# EAGLE design DatacakeWing (EAGLE 9.1.3)
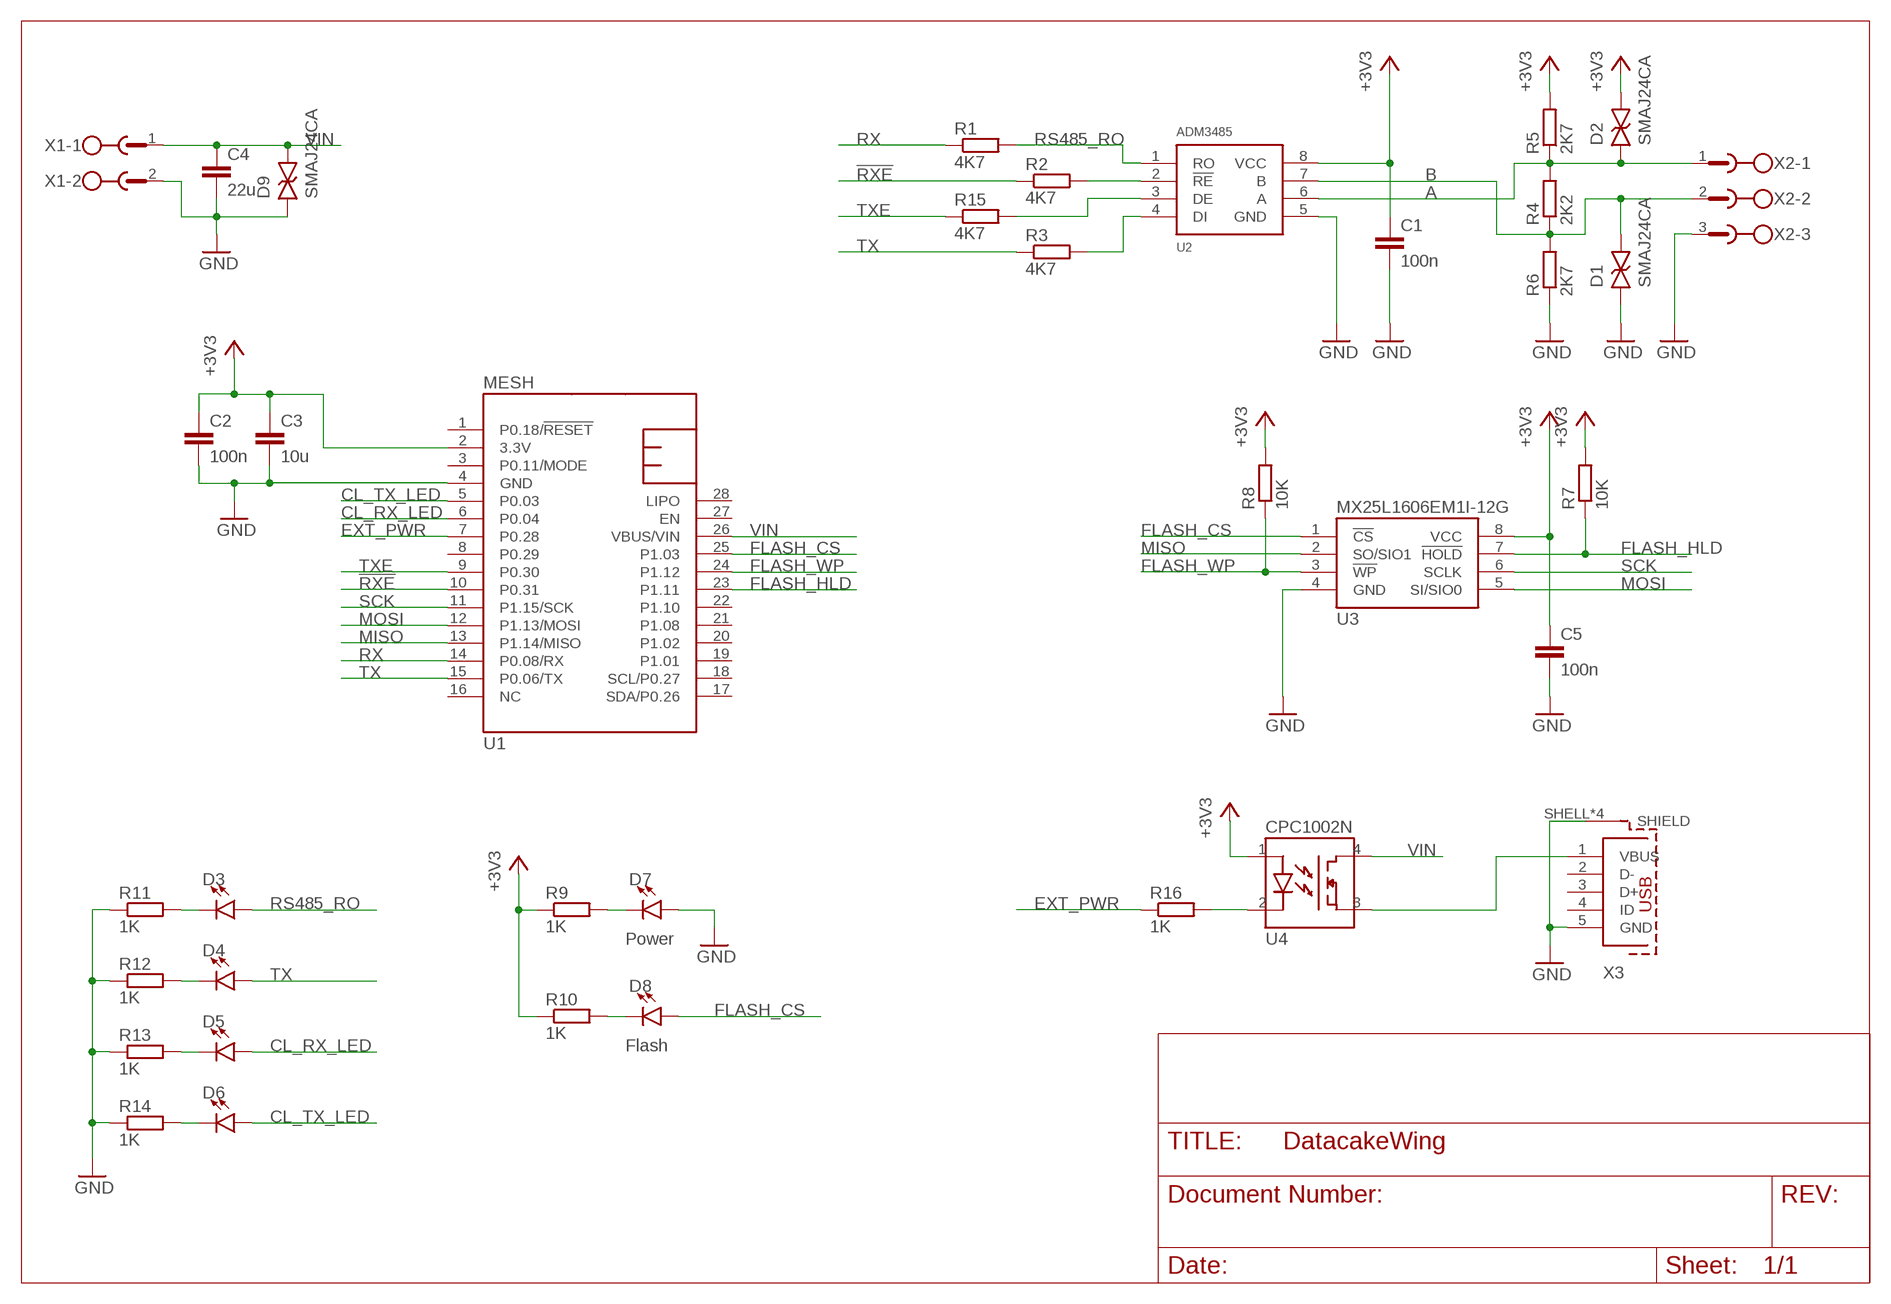
[diagram p0: schematic, sheet 1]

## Parts
C1  100n  C-EUC0603  [C0603]
C2  100n  C-EUC0603  [C0603]
C3  10u  C-EUC0603  [C0603]
C4  22u  C-EUC1210  [C1210]
C5  100n  C-EUC0603  [C0603]
D1  SMAJ24CA  [DO-214AC]
D2  SMAJ24CA  [DO-214AC]
D3  LED0603  [LED-0603]
D4  LED0603  [LED-0603]
D5  LED0603  [LED-0603]
D6  LED0603  [LED-0603]
D7  LED0603  [LED-0603]
D8  LED0603  [LED-0603]
D9  SMAJ24CA  [DO-214AC]
R1  4K7  R-EU_R0402  [R0402]
R2  4K7  R-EU_R0402  [R0402]
R3  4K7  R-EU_R0402  [R0402]
R4  2K2  R-EU_R0402  [R0402]
R5  2K7  R-EU_R0402  [R0402]
R6  2K7  R-EU_R0402  [R0402]
R7  10K  R-EU_R0402  [R0402]
R8  10K  R-EU_R0402  [R0402]
R9  1K  R-EU_R0402  [R0402]
R10  1K  R-EU_R0402  [R0402]
R11  1K  R-EU_R0402  [R0402]
R12  1K  R-EU_R0402  [R0402]
R13  1K  R-EU_R0402  [R0402]
R14  1K  R-EU_R0402  [R0402]
R15  4K7  R-EU_R0402  [R0402]
R16  1K  R-EU_R0402  [R0402]
U1  MESH  [FEATHERWING]
U2  ADM3485  [SO08-0.15]
U3  MX25L1606EM1I-12G  [SO08-0.15]
U4  CPC1002N  [CPC1002N]
X1  MC1,5/2-G-3,5  [MC-2]
X2  MC1,5/3-G-3,5  [MC-3]
X3  629105136821  [629105136821]

## Nets
!RXE: R2.1 U1.10(P0.31)
+3V3: C1.1 C2.1 C3.1 C5.1 D2.2 R5.2 R7.2 R8.2 R9.1 R10.1 U1.2(3.3V) U2.8(VCC) U3.8(VCC) U4.1
A: D2.1 R4.2 R5.1 U2.6(A) X2.1
B: D1.2 R4.1 R6.2 U2.7(B) X2.2
CL_RX_LED: D5.A U1.6(P0.04)
CL_TX_LED: D6.A U1.5(P0.03)
EXT_PWR: R16.1 U1.7(P0.28)
FLASH_CS: D8.A U1.25(P1.03) U3.1(!CS)
FLASH_HLD: R7.1 U1.23(P1.11) U3.7(!HOLD)
FLASH_WP: R8.1 U1.24(P1.12) U3.3(!WP)
GND: C1.2 C2.2 C3.2 C4.2 C5.2 D1.1 D7.A D9.1 R6.1 R11.1 R12.1 R13.1 R14.1 U1.4(GND) U2.5(GND) U3.4(GND) X1.2 X2.3 X3.5(GND) X3.SHELL1(SHIELD) X3.SHELL2(SHIELD) X3.SHELL3(SHIELD) X3.SHELL(SHIELD)
MISO: U1.13(P1.14/MISO) U3.2(SO/SIO1)
MOSI: U1.12(P1.13/MOSI) U3.5(SI/SIO0)
N$1: R2.2 U2.2(!RE)
N$2: D3.C R11.2
N$3: R3.2 U2.4(DI)
N$4: D4.C R12.2
N$5: D5.C R13.2
N$6: D6.C R14.2
N$7: D7.C R9.2
N$8: R15.2 U2.3(DE)
N$9: D8.C R10.2
N$10: U4.3 X3.1(VBUS)
N$12: R16.2 U4.2
RS485_RO: D3.A R1.2 U2.1(RO)
RX: R1.1 U1.14(P0.08/RX)
SCK: U1.11(P1.15/SCK) U3.6(SCLK)
TX: D4.A R3.1 U1.15(P0.06/TX)
TXE: R15.1 U1.9(P0.30)
VIN: C4.1 D9.2 U1.26(VBUS/VIN) U4.4 X1.1
Unconnected: U1.1(P0.18/!RESET) U1.3(P0.11/MODE) U1.8(P0.29) U1.16(NC) U1.17(SDA/P0.26) U1.18(SCL/P0.27) U1.19(P1.01) U1.20(P1.02) U1.21(P1.08) U1.22(P1.10) U1.27(EN) U1.28(LIPO) X3.2(D-) X3.3(D+) X3.4(ID)

## Notes on the sheet
- Power
- Flash

## Library data of the parts
C1-C5 = rcl:C-EU: CAPACITOR, European symbol; SPICEPREFIX: C
D1 D2 D9 = dev:SMAJ24CA: Littlefuse SMAJ24CA The SMAJ series is designed specifically to protect sensitive electronic equipment from voltage transients induced by lightning and other transient voltage events. Datasheet <https://www.littelfuse.com/~/media/electronics/datasheets/tvs_diodes/littelfuse_tvs_diode_smaj_datasheet.pdf.pdf>
D3-D8 = SparkFun-LED:LED: LED (Generic) Standard schematic elements and footprints for 5mm, 3mm, 1206, and 0603 sized LEDs. Generic LEDs with no color specified.
R1-R16 = rcl:R-EU_: RESISTOR, European symbol; SPICEPREFIX: R
U1 = Particle-Devices:MESH
U2 = dev:ADM3485
U3 = dev:MX25L1606E: Macronix Flash MX25L1606E 3V, 10Mbit CMOS Serial Flash Memory
U4 = dev:CPC1002N: IXYS CPC1002N 60V Normally-Open Single-Pole 4-Pin SOP OptoMOS® Relay
X1 = dev:MC1,5/2-G-3,5: Phoenix Contact MC 1,5/ 2-G-3,5 (1844210)
X2 = dev:MC1,5/3-G-3,5: Phoenix Contact MC 1,5/ 3-G-3,5 (1844223)
X3 = Wurth_Elektronik_Electromechanic_Input-Output_Connectors_rev18b:629105136821: WR-COM SMT Horizontal 5 Contacts Micro USB Type B,5 pins=>Code : Con_I-O_COM_MicroUSB_629105136821 <http://katalog.we-online.de/media/images/eican/Con_I-O_COM_MicroUSB_629105136821_pf2.jpg> Details see: http://katalog.we-online.de/en/em/COM_MICRO_SMT_TYPE_B_HORIZONTAL/629105136821?m Created 2014-07-09, Karrer Zheng 2014 (C) Würth Elektronik

## Board
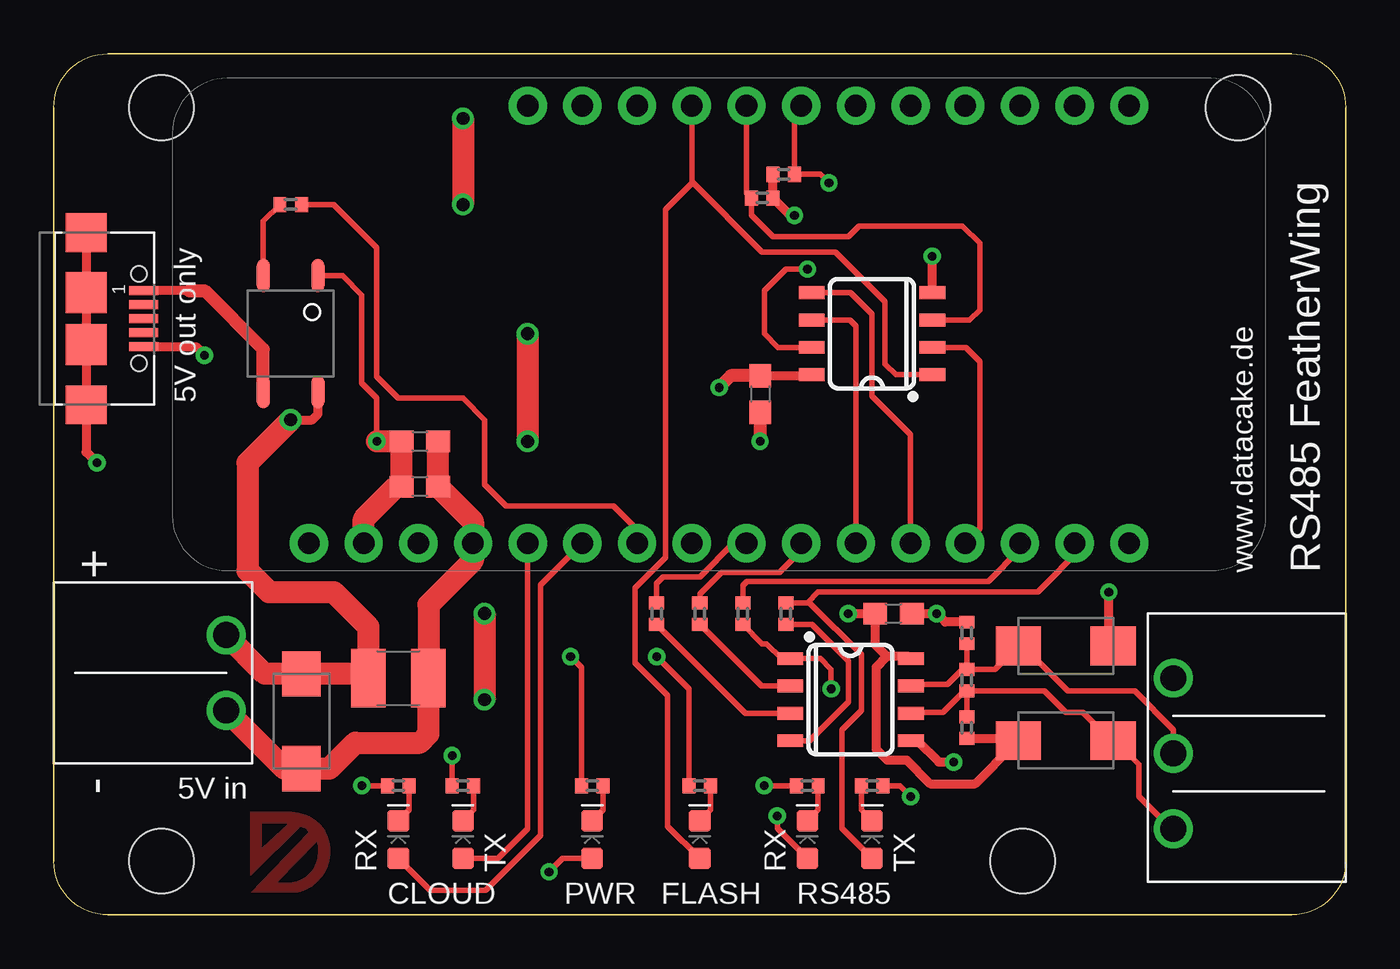
[diagram p1: board, top side]
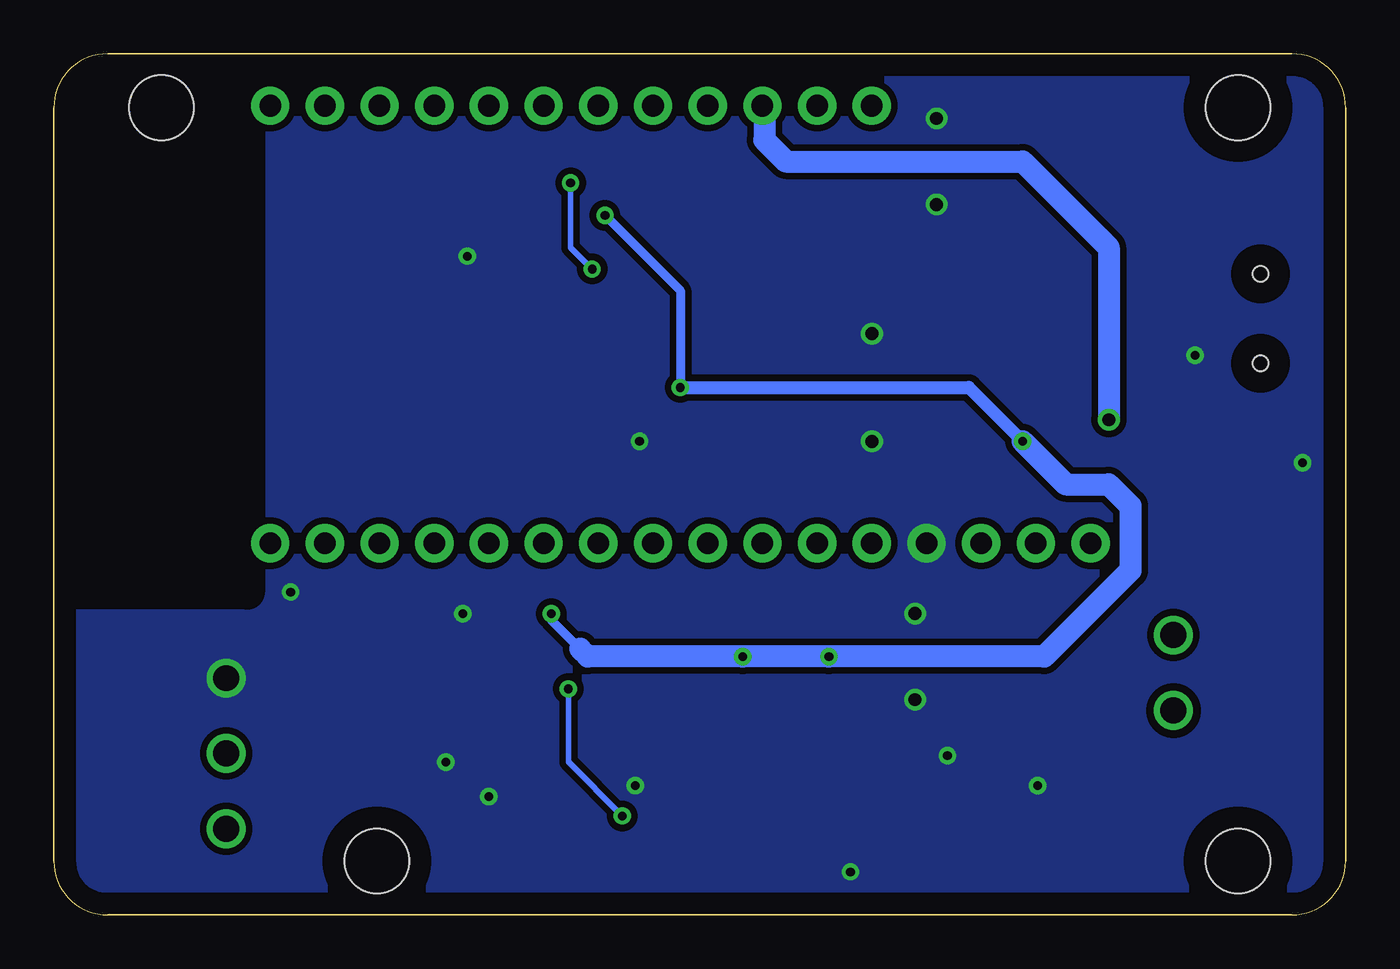
[diagram p2: board, bottom side, seen from below]

Size 60 x 40 mm. Coordinates in mm from the lower left corner, seen from the top.
Outline: 2.5,0 57.5,0
Outline: 60,2.5 60,37.5
Outline: 57.5,40 2.5,40
Outline: 0,37.5 0,2.5
Outline: 2.5,0 arc-90 0,2.5
Outline: 0,37.5 arc-90 2.5,40
Outline: 57.5,40 arc-90 60,37.5
Outline: 60,2.5 arc-90 57.5,0
Outline: 0,2.5 0,37.5
Outline: 2.5,40 57.5,40
Outline: 60,37.5 60,2.5
Outline: 57.5,0 2.5,0
Copper layers (1*16): Top 0.035mm / dielectric 1.6mm / Bottom 0.035mm
Design rules "allpcb_6 *": minimum track width 6mil, minimum drill 0.4mm, track to track 6mil, track to pad 6mil, pad to pad 6mil, via to via 6mil, smd to smd 6mil, copper to edge 40mil, drill to drill 6mil, minimum pad ring 10mil, minimum via ring 8mil, stop-mask expansion 6mil, vias tented up to drill 40mil, thermal gap 10mil
Holes 3 mm at 5,2.5 5,37.5 55,37.5 45,2.5
bRestrict: area 51,15 to 60,40; area 7.1,8.6 to 8.9,10.4

### Footprints (pad centres in the part's own frame; a part is rotated, then mirrored left to right if it is on the bottom)
C0603 = smd 1.1 x 1: 1 -0.85,0; 2 0.85,0
C1210 = smd 1.6 x 2.7: 1 -1.4,0; 2 1.4,0
DO-214AC = smd 2.1 x 1.8: 1 -2.2,0; 2 2.2,0
LED-0603 = smd 1 x 1: A -0.877,0; C 0.877,0
R0402 = smd 0.6 x 0.7: 1 -0.5,0; 2 0.5,0
FEATHERWING = drill 1 pad 1.778: 1 6.35,1.27; 2 8.89,1.27; 3 11.43,1.27; 4 13.97,1.27; 5 16.51,1.27; 6 19.05,1.27; 7 21.59,1.27; 8 24.13,1.27; 9 26.67,1.27; 10 29.21,1.27; 11 31.75,1.27; 12 34.29,1.27; 13 36.83,1.27; 14 39.37,1.27; 15 41.91,1.27; 16 44.45,1.27; 17 44.45,21.59; 18 41.91,21.59; 19 39.37,21.59; 20 36.83,21.59; 21 34.29,21.59; 22 31.75,21.59; 23 29.21,21.59; 24 26.67,21.59; 25 24.13,21.59; 26 21.59,21.59; 27 19.05,21.59; 28 16.51,21.59
SO08-0.15 = smd 0.6 x 1.2: 1 -1.905,-2.8; 2 -0.635,-2.8; 3 0.635,-2.8; 4 1.905,-2.8; 5 1.905,2.8; 6 0.635,2.8; 7 -0.635,2.8; 8 -1.905,2.8
CPC1002N = smd 0.6 x 1.54: 1 -1.27,-2.695; 2 1.27,-2.695; 3 1.27,2.695; 4 -1.27,2.695
MC-2 = drill 1.2: 1 0,0; 2 0,3.5
MC-3 = drill 1.2: 1 0,0; 2 0,3.5; 3 0,7
629105136821 = smd 0.4 x 1.35: 1 -1.3,2.675; 2 -0.65,2.675; 3 0,2.675; 4 0.65,2.675; 5 1.3,2.675 | smd 1.8 x 1.9: SHELL -4,0; SHELL3 4,0 | smd 1.9 x 1.9: SHELL1 -1.2,0; SHELL2 1.2,0 | hole 0.7: -2.075,2.45; 2.075,2.45

### Placement (x,y rotation side)
C1  39,14 0 top
C2  17,19.9 0 top
C3  17,22 0 top
C4  16,11 0 top
C5  32.8,24.2 270 top
D1  47,12.5 180 top
D2  47,8.1 180 top
D3  35,3.5 90 top
D4  38,3.5 90 top
D5  16,3.5 90 top
D6  19,3.5 90 top
D7  25,3.5 90 top
D8  30,3.5 90 top
D9  11.5,9 90 top
R1  32,14 270 top
R2  30,14 270 top
R3  34,14 270 top
R4  42.4,10.9 270 top
R5  42.4,8.7 270 top
R6  42.4,13.1 270 top
R7  33.9,34.4 180 top
R8  32.9,33.3 0 top
R9  25,6 0 top
R10  30,6 0 top
R11  35,6 0 top
R12  38,6 180 top
R13  16,6 0 top
R14  19,6 0 top
R15  28,14 270 top
R16  11,33 180 top
U1  5.5,16 0 top
U2  37,10 270 top
U3  38,27 90 top
U4  11,27 180 top
X1  8,13 180 top
X2  52,4 0 top
X3  1.5,27.7 270 top

### Tracks (layer width: path | path; a pad name or v marks a point on that pad's centre or on a via)
!RXE
  Top 0.254: R2.1 30,14.9 31.01,15.91 33.71,15.91 34.71,16.91 U1.10
+3V3  (via drill 0.4)
  Top 0.254: R9.1 24.5,11.5 v24,12 | R10.1 29.5,10.5 v28,12 | v15,22 15,24 14.3,24.7 14.3,28.8 13.4,29.7 U4.1
  Top 0.406: U2.8 39.7,12 38.7,12 | 38.7,12 38.15,12.55 C1.1 v36.9,14 | 44.6,7.9 D2.2 | 38.7,12 38.2,11.5 38.2,7.7 38.7,7.2 39.6,7.2 40.7,6.1 42.8,6.1 44.6,7.9 | R5.2 44.3,8.2 44.6,7.9 | R7.2 R8.2 34.2,32.5 v34.4,32.5 | C5.1 35.16,25.05 U3.8
  Top 0.61: C5.1 31.45,25.05 v30.9,24.5
  Top 1.016: U1.2 14.39,18.39 15.9,19.9 C2.1 C3.1 v15,22
  Bottom 0.406: 35.56,12.36 36.9,13.7 v36.9,14 | v30.9,24.5 30.9,29 v34.4,32.5
  Bottom 0.61: v30.9,24.5 17.5,24.5 v15,22
  Bottom 1.016: v15,22 13,20 11,20 10,19 10,16 14,12 v24,12 v28,12 35.2,12 35.56,12.36
A
  Top 0.254: U2.6 39.84,9.4 41.3,9.4 42.3,10.4 R4.2 | R4.2 R5.1 | R4.2 46,10.4 47,9.4 47.8,9.4 49.1,8.1 | 50.4,7 50.4,5.5 51.9,4 X2.1 | 49.1,8.1 D2.1 | 50.4,7 | 50.4,7 49.3,8.1 49.1,8.1
B
  Top 0.254: X2.2 52,8.6 50.2,10.4 47.1,10.4 45,12.5 D1.2 43.7,11.4 R4.1 | R6.2 R4.1 | R4.1 42.2,11.4 41.5,10.7 39.87,10.7 U2.7
CL_RX_LED
  Top 0.254: U1.6 22.6,15.32 22.6,3.7 20.04,1.14 17.48,1.14 D5.A
CL_TX_LED
  Top 0.254: D6.A 20.62,2.62 22,4 U1.5
EXT_PWR
  Top 0.254: R16.1 13,33 15,31 15,25 16,24 19,24 20,23 20,20 21,19 26,19 27.09,17.91 U1.7
FLASH_CS
  Top 0.254: D8.A 28.5,4.12 28.5,10.2 27,11.7 27,15.2 28.4,16.6 28.4,32.76 29.63,33.99 U1.25 29.63,34.07 32.9,30.8 36.3,30.8 38.6,28.5 38.6,25.6 39.1,25.1 U3.1
FLASH_HLD  (via drill 0.4)
  Top 0.254: U1.23 34.4,37.28 R7.1 35.6,34.4 v36,34 | v35,30 34,30 33,29 33,27 33.63,26.36 U3.7
  Bottom 0.254: v35,30 36,31 v36,34
FLASH_WP
  Top 0.254: U1.24 32.17,33.53 R8.1 32.4,32.5 33.4,31.5 36.9,31.5 37.4,32 42.2,32 43,31.2 43,28.1 42.53,27.64 U3.3
GND  (via drill 0.4, 0.6)
  Top 0.254: R12.1 39.3,6 v39.8,5.5 | R11.1 v33,6 | D7.A 23.62,2.62 v23,2 | R14.1 v18.5,7.4 | R13.1 v14.3,6
  Top 0.406: U2.5 40.1,8.1 41.1,7.1 v41.8,7.1 | C1.2 v41,14 41.4,13.6 R6.1 | D1.1 49,12.7 v49,15 | X3.5 6.6,26.4 v7,26 | X3.SHELL X3.SHELL1 X3.SHELL2 X3.SHELL3 1.5,21.5 v2,21 | U3.4 v40.8,30.6
  Top 0.61: C5.2 v32.8,22
  Top 1.016: C3.2 C2.2 19.47,18.28 U1.4 19.47,16.47 17.4,14.4 C4.2 17.4,8.4 17,8 14,8 12.8,6.8 D9.1 10.7,6.8 X1.2 | v19,37 v19,33 | v22,27 v22,22 | v20,14 v20,10
  pour Bottom (isolate 0.305, no thermals): 0,40 60,40 60,0 0,0
MISO
  Top 0.254: U1.13 43,17.94 43,25.7 42.35,26.35 40.81,26.35 U3.2
MOSI
  Top 0.254: U1.12 39.79,22.31 38,24.1 38,27.9 36.99,28.91 U3.5
N$1
  Top 0.254: R2.2 32.87,10.63 U2.2
N$2
  Top 0.254: R11.2 35.5,4.88 D3.C
N$3
  Top 0.254: R3.2 35,13.5 | 35,13.5 35.2,13.5 | U2.4 35.09,8.1 36.9,9.9 36.9,11.8 35.2,13.5 | 35,13.5 35.2,13.5
N$4
  Top 0.254: R12.2 37.5,4.88 D4.C
N$5
  Top 0.254: R13.2 16.5,4.88 D5.C
N$6
  Top 0.254: R14.2 19.5,4.88 D6.C
N$7
  Top 0.254: R9.2 25.5,4.88 D7.C
N$8
  Top 0.254: R15.2 32.13,9.37 U2.3
N$9
  Top 0.254: R10.2 30.5,4.88 D8.C
N$10
  Top 0.406: 6.3,29 X3.1
  Top 0.61: U4.3 9.73,26.27 7,29 6.3,29
N$11
  cutout Top: 12.21,3.35 10.43,1.54 10.95,1.54 10.96,1.54 11.01,1.54 11.08,1.54 11.17,1.56 11.28,1.58 11.4,1.63 11.54,1.7 11.65,1.77 11.69,1.8 11.72,1.82 11.82,1.91 11.93,2.03 12.01,2.15 12.08,2.25 12.13,2.34 12.16,2.42 12.18,2.47 12.18,2.48 12.19,2.5 12.2,2.55 12.22,2.63 12.24,2.74 12.25,2.87 12.25,3.01 12.24,3.18 12.22,3.31
N$12
  Top 0.254: U4.2 9.73,32.23 R16.2
N$13
  cutout Top: 9.66,3.16 10.81,4.22 9.66,4.22
N$14
  pour Top: 9.15,1.02 11.87,3.83 11.86,3.85 11.82,3.9 11.75,3.97 11.68,4.01 11.61,4.05 11.54,4.07 11.48,4.09 11.44,4.09 11.43,4.1 9.15,1.84 9.15,4.8 10.83,4.8 10.86,4.79 10.94,4.79 11.05,4.78 11.2,4.76 11.36,4.74 11.53,4.7 11.7,4.64 11.82,4.59 11.86,4.57 11.93,4.52 12.16,4.38 12.36,4.21 12.49,4.06 12.55,3.96 12.57,3.92 12.58,3.89 12.63,3.8 12.7,3.62 12.76,3.39 12.81,3.13 12.82,2.84 12.77,2.52 12.67,2.19 12.54,1.93 12.49,1.85 12.42,1.77 12.22,1.54 11.95,1.31 11.69,1.16 11.46,1.07 11.26,1.03 11.1,1.01 11,1.01 10.97,1.02
RS485_RO  (via drill 0.4)
  Top 0.254: v33.6,4.6 33.6,4.02 D3.A | R1.2 32.9,12.6 33.1,12.6 33.8,11.9 U2.1 35.59,11.9 36.1,11.4 v36.1,10.5
  Bottom 0.254: v36.1,10.5 36.1,7.1 v33.6,4.6
RX
  Top 0.254: U1.14 44.87,16.97 43.4,15.5 32.2,15.5 32,15.3 R1.1
SCK
  Top 0.254: U1.11 37.25,27.35 36.97,27.64 U3.6
TX
  Top 0.254: U1.15 47.41,16.71 46.15,15.45 45.7,15 35.5,15 35,14.5 | D4.A 36.6,4.02 36.6,8.6 37.5,9.5 37.5,12.1 35.1,14.5 35,14.5 | R3.1 35,14.5
TXE
  Top 0.254: R15.1 28,15.4 28.3,15.7 30,15.7 31.57,17.27 U1.9
VIN  (via drill 0.6)
  Top 0.406: v11,23 12,23 12.27,23.27 U4.4
  Top 1.016: v11,23 9,21 9,16 10,15 13,15 14.6,13.4 C4.1 14.4,11.2 D9.2 9.8,11.2 X1.1
  Bottom 1.016: U1.26 27,37.5 27,36 26,35 15,35 11,31 v11,23

### Text on the board
tPlace: 5V out only | + | www.datacake.de | RS485 FeatherWing | - | 5V in | RX | TX | RX | TX | CLOUD | PWR | FLASH | RS485